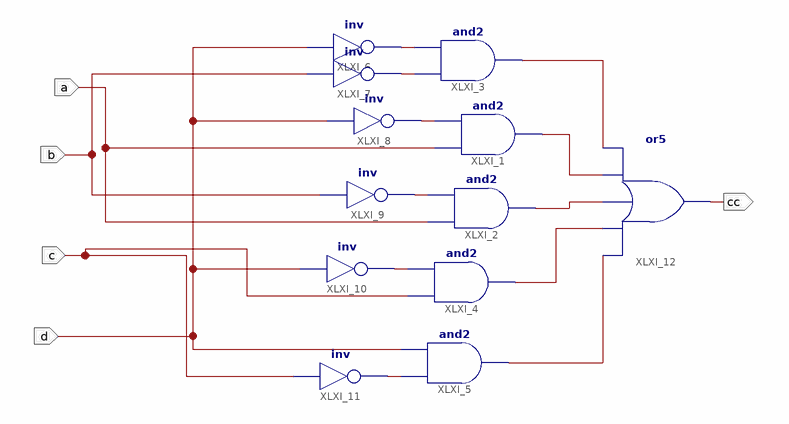
[diagram p0: schematic sheet 1]
// Xilinx ISE schematic hexC.sch (spartan6) as structural Verilog: 12 symbols, 5 ports
module hexC (
  input  a,
  input  c,
  input  d,
  input  b,
  output cc
);

  wire XLXN_1, XLXN_2, XLXN_3, XLXN_4, XLXN_5, XLXN_6, XLXN_17, XLXN_18, XLXN_19, XLXN_20, XLXN_21;

  and XLXI_1 (XLXN_18, a, XLXN_3);
  and XLXI_2 (XLXN_19, a, XLXN_4);
  and XLXI_3 (XLXN_17, XLXN_2, XLXN_1);
  and XLXI_4 (XLXN_20, c, XLXN_5);
  and XLXI_5 (XLXN_21, XLXN_6, d);
  not XLXI_6 (XLXN_1, d);
  not XLXI_7 (XLXN_2, b);
  not XLXI_8 (XLXN_3, d);
  not XLXI_9 (XLXN_4, b);
  not XLXI_10 (XLXN_5, d);
  not XLXI_11 (XLXN_6, c);
  or XLXI_12 (cc, XLXN_21, XLXN_20, XLXN_19, XLXN_18, XLXN_17);
endmodule
